# Altium project MINI_FLY.PrjPcb
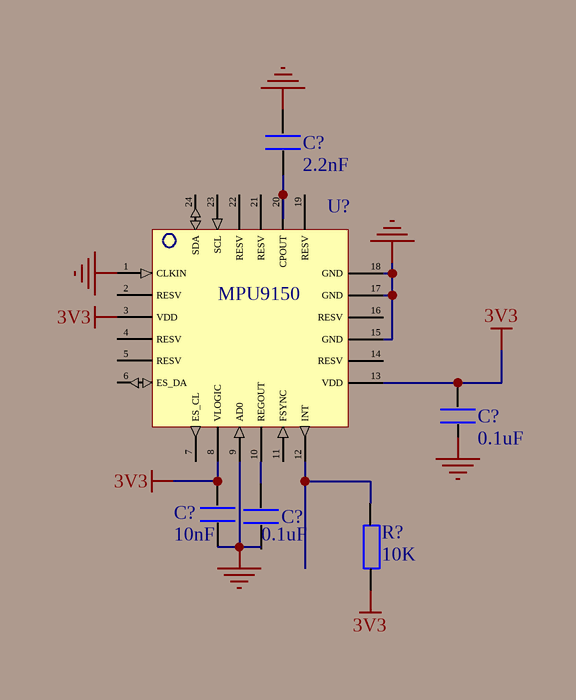
[diagram p0: MPU9150.SchDoc]
1 sheet, 6 parts. Net scope: global (net labels, ports and power ports of the same name join across sheets).

## Sheet MPU9150.SchDoc
size A4

### Parts
(Parts that share a designator on the sheet are numbered #1, #2 ... from top to bottom, then left to right.)
C?#1  2.2nF  [0402]
C?#2  0.1uF  [0402]
C?#3  10nF  [0402]
C?#4  0.1uF  [0402]
R?  10K  [0402]
U?  MPU9150

### Nets
3V3: C?#2.1 C?#3.1 R?.1 U?.3(VDD) U?.8(VLOGIC) U?.13(VDD)
GND: C?#1.1 C?#3.2 U?.1(CLKIN) U?.9(AD0) U?.15(GND) U?.17(GND) U?.18(GND)
NetC?#1_2: C?#1.2 U?.20(CPOUT)
NetC?#4_1: C?#4.1 U?.10(REGOUT)
NetR?_2: R?.2 U?.12(INT)

Not connected (* = marked no-connect by the designer): C?#2 2; C?#4 2; U? 2(RESV) 4(RESV) 5(RESV) 6(ES_DA) 7(ES_CL) 11(FSYNC) 14(RESV) 16(RESV) 19(RESV) 21(RESV) 22(RESV) 23(SCL) 24(SDA)

### Notes on the sheet
- Labels drawn without touching a wire or pin: GND

### Library data of the parts
C?#1-C?#4 = C
R? = R
U? = MPU_9150